# EAGLE board RK05ex (EAGLE 6.6.0), part 1 of 2
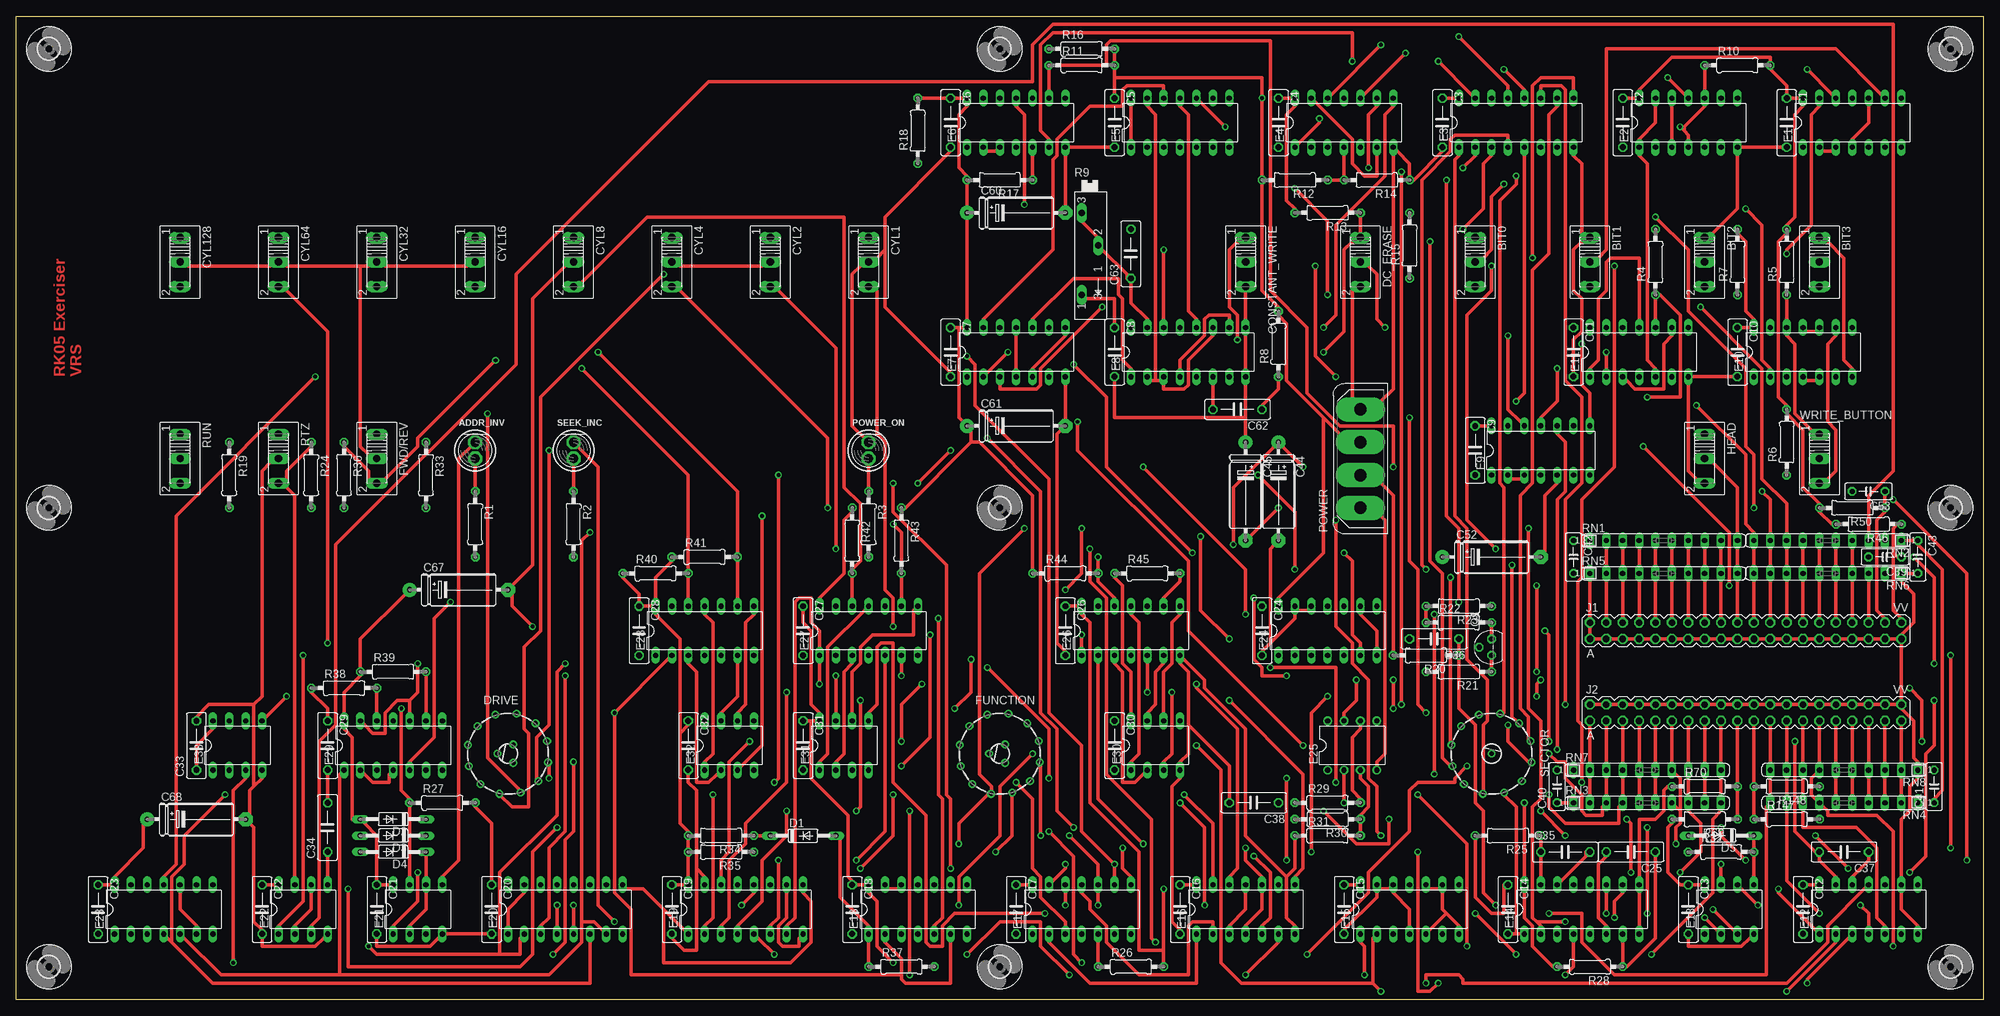
[diagram p5: board, top side]
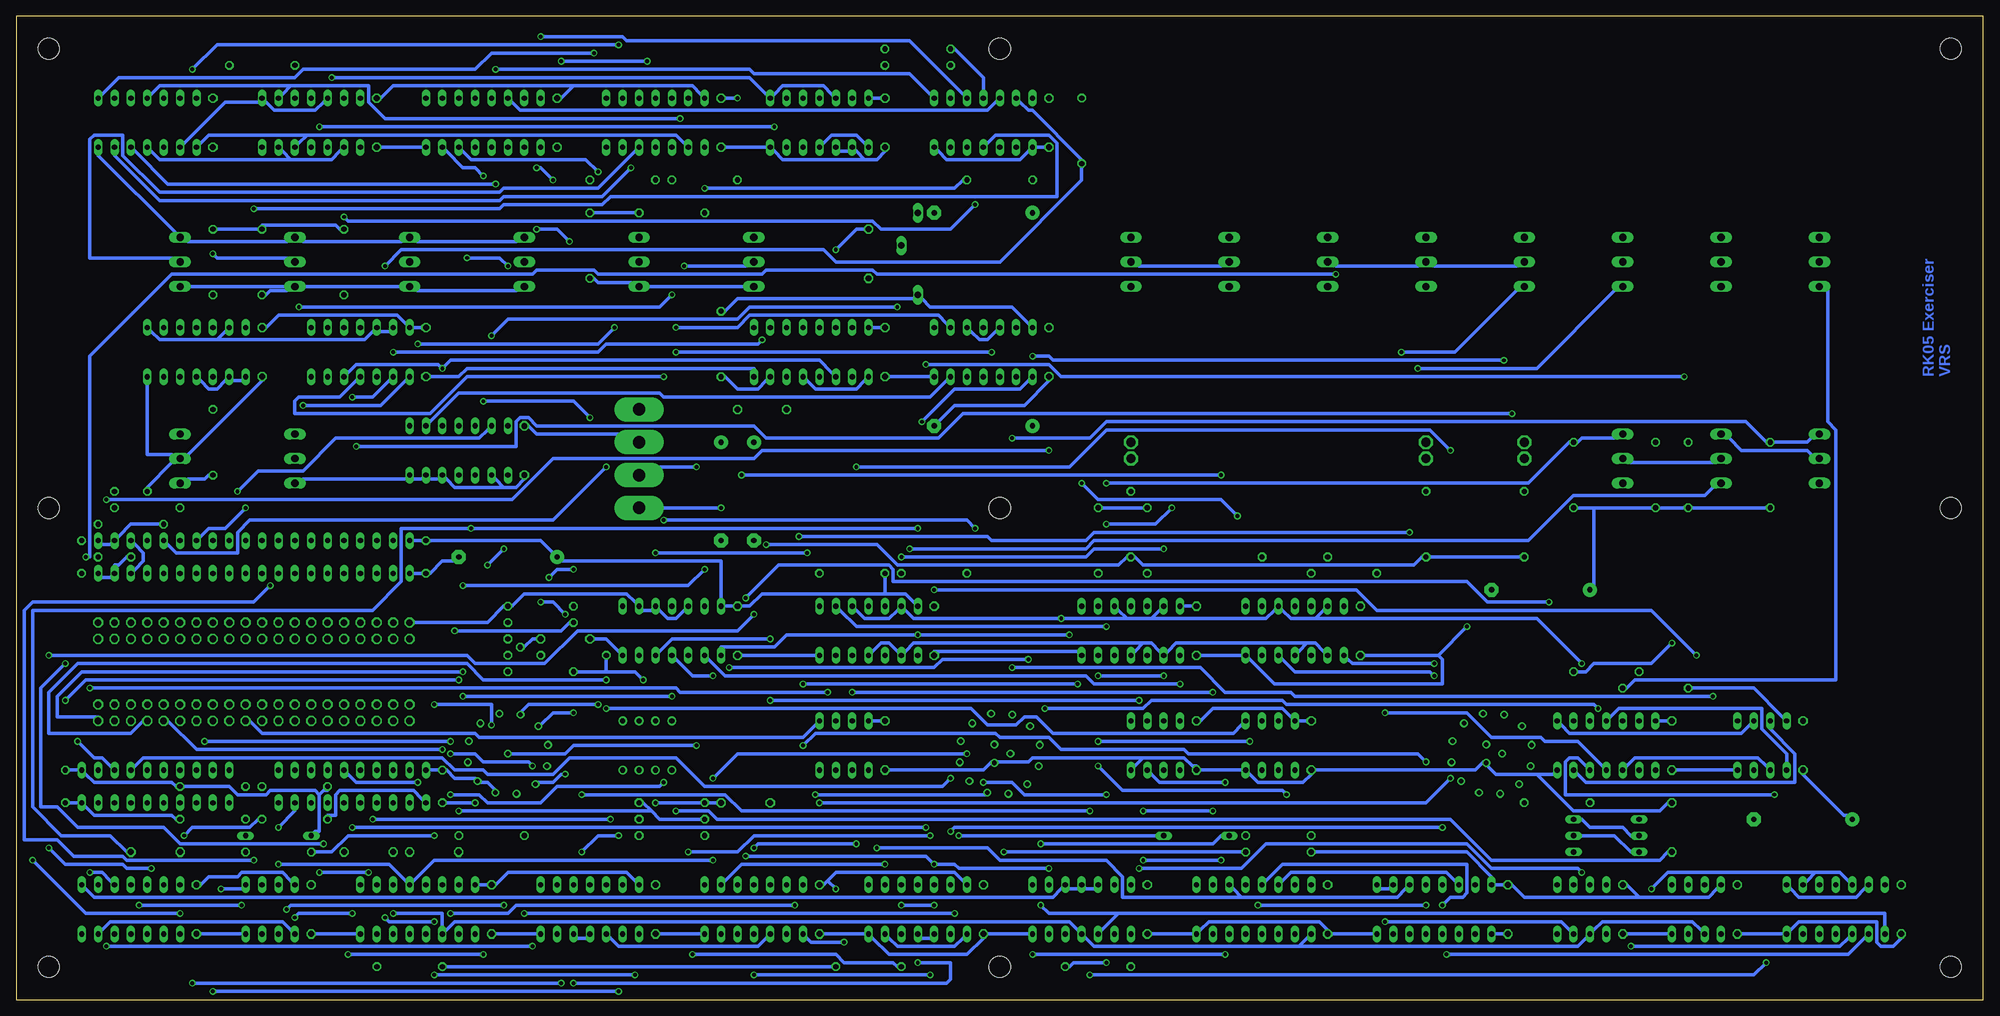
[diagram p6: board, bottom side, seen from below]

Size 304.8 x 152.4 mm. Coordinates in mm from the lower left corner, seen from the top.
Outline: 0,0 0,152.4 304.8,152.4 304.8,0 0,0
Copper layers (1*16): Top 0.035mm / dielectric 1.5mm / Bottom 0.035mm
Design rules "10mils": minimum track width 10mil, minimum drill 24mil, track to track 10mil, track to pad 10mil, pad to pad 10mil, via to via 10mil, smd to smd 10mil, copper to edge 25mil, drill to drill 10mil, minimum pad ring 10mil, minimum via ring 8mil, stop-mask expansion 0mil, vias tented up to drill 0mil, thermal gap 10mil
Net classes: 0 default: width 0.508 mm, clearance 0.279 mm

## Footprints (pad centres in the part's own frame; a part is rotated, then mirrored left to right if it is on the bottom)
BULB = drill 1.422 octagon: A 0,0; B 0,2.54
255SB = drill 1.118 long: 1 -3.81,0; 2 0,0; 3 3.81,0
C075-032X103 = drill 0.914 octagon: 1 -3.81,0; 2 3.81,0
C050-025X075 = drill 0.813 octagon: 1 -2.54,0; 2 2.54,0
E15-5 = drill 0.813 pad 2.159: + -7.62,0 | drill 0.813 pad 2.159 octagon: - 7.62,0
DO35-10 = drill 0.813 long: A 5.08,0; C -5.08,0
DO35Z10 = drill 0.813 long: A 5.08,0; C -5.08,0
50-3POLE30 = drill 0.7 pad 1.2: 1 6.207,-1.342; 2 4.704,-4.265; 3 1.941,-6.046; 4 -1.342,-6.207; 5 -4.265,-4.704; 6 -6.046,-1.941; 7 -6.207,1.342; 8 -4.704,4.265; 9 -1.941,6.046; 10 1.342,6.207; 11 4.265,4.704; 12 6.046,1.941; C1 0.825,-1.429; C2 -1.65,0; C3 0.825,1.429
DIL14 = drill 0.813 long: 1 -7.62,-3.81; 2 -5.08,-3.81; 3 -2.54,-3.81; 4 0,-3.81; 5 2.54,-3.81; 6 5.08,-3.81; 7 7.62,-3.81; 8 7.62,3.81; 9 5.08,3.81; 10 2.54,3.81; 11 0,3.81; 12 -2.54,3.81; 13 -5.08,3.81; 14 -7.62,3.81
DIL16 = drill 0.813 long: 1 -8.89,-3.81; 2 -6.35,-3.81; 3 -3.81,-3.81; 4 -1.27,-3.81; 5 1.27,-3.81; 6 3.81,-3.81; 7 6.35,-3.81; 8 8.89,-3.81; 9 8.89,3.81; 10 6.35,3.81; 11 3.81,3.81; 12 1.27,3.81; 13 -1.27,3.81; 14 -3.81,3.81; 15 -6.35,3.81; 16 -8.89,3.81
DIL08 = drill 0.813 long: 1 -3.81,-3.81; 2 -1.27,-3.81; 3 1.27,-3.81; 4 3.81,-3.81; 5 3.81,3.81; 6 1.27,3.81; 7 -1.27,3.81; 8 -3.81,3.81
DIL08' = drill 0.813 pad 1.27: 1 -3.81,-3.81; 2 -1.27,-3.81; 3 1.27,-3.81; 4 3.81,-3.81; 5 3.81,3.81; 6 1.27,3.81; 7 -1.27,3.81; 8 -3.81,3.81
DEC40PINV = drill 1.016 octagon: A -24.13,-1.27; AA 3.81,-1.27; B -24.13,1.27; BB 3.81,1.27; C -21.59,-1.27; CC 6.35,-1.27; D -21.59,1.27; DD 6.35,1.27; E -19.05,-1.27; EE 8.89,-1.27; F -19.05,1.27; FF 8.89,1.27; H -16.51,-1.27; HH 11.43,-1.27; J -16.51,1.27; JJ 11.43,1.27; K -13.97,-1.27; KK 13.97,-1.27; L -13.97,1.27; LL 13.97,1.27; M -11.43,-1.27; MM 16.51,-1.27; N -11.43,1.27; NN 16.51,1.27; P -8.89,-1.27; PP 19.05,-1.27; R -8.89,1.27; RR 19.05,1.27; S -6.35,-1.27; SS 21.59,-1.27; T -6.35,1.27; TT 21.59,1.27; U -3.81,-1.27; UU 24.13,-1.27; V -3.81,1.27; VV 24.13,1.27; W -1.27,-1.27; X -1.27,1.27; Y 1.27,-1.27; Z 1.27,1.27
FLOPPY-4 = drill 1.93 pad 3.81 long: 1 7.62,0; 2 2.54,0; 3 -2.54,0; 4 -7.62,0
TO92E = drill 0.813 octagon: B1 -1.27,0; B2 1.27,0; E 0,1.905
0207/10 = drill 0.813 octagon: 1 -5.08,0; 2 5.08,0
SP19L = drill 1.016 long: A 5.715,-1.27; E -6.985,-1.27; S -1.905,1.27
SIL10 = drill 0.813 long: 1 -11.43,0; 2 -8.89,0; 3 -6.35,0; 4 -3.81,0; 5 -1.27,0; 6 1.27,0; 7 3.81,0; 8 6.35,0; 9 8.89,0; 10 11.43,0
50-1POLE30 = drill 0.7 pad 1.2: 1 6.207,-1.342; 2 4.704,-4.265; 3 1.941,-6.046; 4 -1.342,-6.207; 5 -4.265,-4.704; 6 -6.046,-1.941; 7 -6.207,1.342; 8 -4.704,4.265; 9 -1.941,6.046; 10 1.342,6.207; 11 4.265,4.704; 12 6.046,1.941; C 0,0
3,3 = hole 3.3: 0,0

## Placement (x,y rotation side)
ADDR_INV  [BULB]  71.12,83.82 0 top
BIT0  [255SB]  226.06,114.3 270 top
BIT1  [255SB]  243.84,114.3 270 top
BIT2  [255SB]  261.62,114.3 270 top
BIT3  [255SB]  279.4,114.3 270 top
C1  .01uf  [C075-032X103]  274.32,135.89 270 top
C2  .01uf  [C075-032X103]  248.92,135.89 270 top
C3  .01uf  [C075-032X103]  220.98,135.89 270 top
C4  .01uf  [C075-032X103]  195.58,135.89 270 top
C5  .01uf  [C075-032X103]  170.18,135.89 270 top
C6  .01uf  [C075-032X103]  144.78,135.89 270 top
C7  .01uf  [C075-032X103]  144.78,100.33 270 top
C8  .01uf  [C075-032X103]  170.18,100.33 270 top
C9  .01uf  [C075-032X103]  226.06,85.09 270 top
C10  .01uf  [C075-032X103]  266.7,100.33 270 top
C11  .01uf  [C075-032X103]  241.3,100.33 270 top
C12  .01uf  [C075-032X103]  276.86,13.97 270 top
C13  .01uf  [C075-032X103]  259.08,13.97 270 top
C14  .01uf  [C075-032X103]  231.14,13.97 270 top
C15  .01uf  [C075-032X103]  205.74,13.97 270 top
C16  .01uf  [C075-032X103]  180.34,13.97 270 top
C17  .01uf  [C075-032X103]  154.94,13.97 270 top
C18  .01uf  [C075-032X103]  129.54,13.97 270 top
C19  .01uf  [C075-032X103]  101.6,13.97 270 top
C20  .01uf  [C075-032X103]  73.66,13.97 270 top
C21  .01uf  [C075-032X103]  55.88,13.97 270 top
C22  .01uf  [C075-032X103]  38.1,13.97 270 top
C23  .01uf  [C075-032X103]  12.7,13.97 270 top
C24  .01uf  [C075-032X103]  193.04,57.15 270 top
C25  470pf  [C075-032X103]  250.19,22.86 180 top
C26  .01uf  [C075-032X103]  162.56,57.15 270 top
C27  .01uf  [C075-032X103]  121.92,57.15 270 top
C28  .01uf  [C075-032X103]  96.52,57.15 270 top
C29  .01uf  [C075-032X103]  48.26,39.37 270 top
C30  .01uf  [C075-032X103]  170.18,39.37 270 top
C31  .01uf  [C075-032X103]  121.92,39.37 270 top
C32  .01uf  [C075-032X103]  104.14,39.37 270 top
C33  .01uf  [C075-032X103]  27.94,39.37 90 top
C34  .001uf  [C075-032X103]  48.26,26.67 90 top
C35  470pf  [C075-032X103]  240.03,22.86 0 top
C36  .033uf  [C075-032X103]  219.71,55.88 180 top
C37  .001uf  [C075-032X103]  283.21,22.86 180 top
C38  100pf  [C075-032X103]  191.77,30.48 180 top
C39  .001  [C050-025X075]  289.56,68.58 180 top
C40  .22uf  [C050-025X075]  238.76,33.02 90 top
C41  .22uf  [C050-025X075]  297.18,33.02 90 top
C42  .22uf  [C050-025X075]  241.3,68.58 270 top
C43  .22uf  [C050-025X075]  294.64,68.58 270 top
C44  6.8uf  [E15-5]  195.58,78.74 270 top
C45  6.8uf  [E15-5]  190.5,78.74 270 top
C52  39uf  [E15-5]  228.6,68.58 0 top
C53  .001  [C050-025X075]  287.02,78.74 180 top
C60  6.8uf  [E15-5]  154.94,121.92 0 top
C61  6.8uf  [E15-5]  154.94,88.9 0 top
C62  27pf  [C075-032X103]  189.23,91.44 180 top
C63  47pf  [C075-032X103]  172.72,115.57 90 top
C67  6.8uf  [E15-5]  68.58,63.5 0 top
C68  6.8uf  [E15-5]  27.94,27.94 0 top
CONSTANT_WRITE  [255SB]  190.5,114.3 270 top
CYL1  [255SB]  132.08,114.3 270 top
CYL2  [255SB]  116.84,114.3 270 top
CYL4  [255SB]  101.6,114.3 270 top
CYL8  [255SB]  86.36,114.3 270 top
CYL16  [255SB]  71.12,114.3 270 top
CYL32  [255SB]  55.88,114.3 270 top
CYL64  [255SB]  40.64,114.3 270 top
CYL128  [255SB]  25.4,114.3 270 top
D1  D664  [DO35-10]  121.92,25.4 0 top
D2  D664  [DO35-10]  58.42,27.94 180 top
D3  D664  [DO35-10]  58.42,25.4 180 top
D4  D664  [DO35-10]  58.42,22.86 180 top
D5  1N746  [DO35Z10]  264.16,25.4 180 top
DC_ERASE  [255SB]  208.28,114.3 270 top
DRIVE  50-3POLE30  [50-3POLE30]  76.2,38.1 0 top
E1  74LS10N  [DIL14]  284.48,135.89 0 top
E2  74LS74N  [DIL14]  259.08,135.89 0 top
E3  74LS42N  [DIL16]  232.41,135.89 0 top
E4  74LS20N  [DIL14]  205.74,135.89 0 top
E5  74LS74N  [DIL14]  180.34,135.89 0 top
E6  74LS04N  [DIL14]  154.94,135.89 0 top
E7  74LS00N  [DIL14]  154.94,100.33 0 top
E8  74123N  [DIL16]  181.61,100.33 0 top
E9  N8881N  [DIL14]  236.22,85.09 0 top
E10  74LS00N  [DIL14]  276.86,100.33 0 top
E11  74LS74N  [DIL14]  251.46,100.33 0 top
E12  74LS04N  [DIL14]  287.02,13.97 0 top
E13  DS75451N  [DIL08]  265.43,13.97 0 top
E14  74LS123N  [DIL16]  242.57,13.97 0 top
E15  74LS00N  [DIL14]  215.9,13.97 0 top
E16  74LS10N  [DIL14]  190.5,13.97 0 top
E17  74LS00N  [DIL14]  165.1,13.97 0 top
E18  74LS74N  [DIL14]  139.7,13.97 0 top
E19  74LS193N  [DIL16]  113.03,13.97 0 top
E20  74LS193N  [DIL16]  85.09,13.97 0 top
E21  DS75451N  [DIL08]  62.23,13.97 0 top
E22  DS75451N  [DIL08]  44.45,13.97 0 top
E23  74LS10N  [DIL14]  22.86,13.97 0 top
E24  74LS20N  [DIL14]  203.2,57.15 0 top
E25  LM741P  [DIL08']  207.01,39.37 0 top
E26  74LS00N  [DIL14]  172.72,57.15 0 top
E27  74LS00N  [DIL14]  132.08,57.15 0 top
E28  74LS00N  [DIL14]  106.68,57.15 0 top
E29  74LS00N  [DIL14]  58.42,39.37 0 top
E30  DS75451N  [DIL08]  176.53,39.37 0 top
E31  DS75451N  [DIL08]  128.27,39.37 0 top
E32  DS75451N  [DIL08]  110.49,39.37 0 top
E33  DS75451N  [DIL08]  34.29,39.37 0 top
FUNCTION  50-3POLE30  [50-3POLE30]  152.4,38.1 0 top
FWD/REV  [255SB]  55.88,83.82 270 top
HEAD  [255SB]  261.62,83.82 270 top
J1  DEC40PINSV  [DEC40PINV]  267.97,57.15 0 top
J2  DEC40PINSV  [DEC40PINV]  267.97,44.45 0 top
POWER  [FLOPPY-4]  208.28,83.82 90 top
POWER_ON  [BULB]  132.08,83.82 0 top
Q1  2N4894  [TO92E]  228.6,54.61 90 top
R1  0ohm  [0207/10]  71.12,73.66 270 top
R2  0ohm  [0207/10]  86.36,73.66 270 top
R3  0ohm  [0207/10]  132.08,73.66 270 top
R4  1K  [0207/10]  254,114.3 90 top
R5  56K  [0207/10]  274.32,114.3 90 top
R6  56K  [0207/10]  274.32,86.36 90 top
R7  1K  [0207/10]  266.7,114.3 90 top
R8  5.6k  [0207/10]  195.58,101.6 90 top
R9  10K  [SP19L]  166.37,114.94 270 top
R10  1K  [0207/10]  266.7,144.78 0 top
R11  1K  [0207/10]  165.1,144.78 0 top
R12  330  [0207/10]  198.12,127 180 top
R13  330  [0207/10]  203.2,121.92 180 top
R14  750  [0207/10]  210.82,127 180 top
R15  750  [0207/10]  215.9,116.84 90 top
R16  1K  [0207/10]  165.1,147.32 0 top
R17  1K  [0207/10]  152.4,127 180 top
R18  1K  [0207/10]  139.7,134.62 90 top
R19  1K  [0207/10]  33.02,81.28 270 top
R20  470K  [0207/10]  218.44,53.34 180 top
R21  330  [0207/10]  223.52,50.8 180 top
R22  120  [0207/10]  223.52,58.42 0 top
R23  68  [0207/10]  223.52,60.96 180 top
R24  1K  [0207/10]  45.72,81.28 270 top
R25  10K  [0207/10]  231.14,25.4 180 top
R26  1K  [0207/10]  172.72,5.08 0 top
R27  1K  [0207/10]  66.04,30.48 0 top
R28  22K  [0207/10]  243.84,5.08 180 top
R29  100K  [0207/10]  203.2,30.48 0 top
R30  100K  [0207/10]  203.2,27.94 180 top
R31  1M  [0207/10]  203.2,25.4 0 top
R32  1K  [0207/10]  264.16,22.86 0 top
R33  1K  [0207/10]  63.5,81.28 270 top
R34  1K  [0207/10]  109.22,25.4 180 top
R35  1K  [0207/10]  109.22,22.86 180 top
R36  1K  [0207/10]  50.8,81.28 270 top
R37  1K  [0207/10]  137.16,5.08 0 top
R38  1K  [0207/10]  50.8,48.26 0 top
R39  1K  [0207/10]  58.42,50.8 0 top
R40  1K  [0207/10]  99.06,66.04 0 top
R41  1K  [0207/10]  106.68,68.58 0 top
R42  1K  [0207/10]  129.54,71.12 270 top
R43  1K  [0207/10]  137.16,71.12 270 top
R44  1K  [0207/10]  162.56,66.04 0 top
R45  1K  [0207/10]  175.26,66.04 0 top
R46  390  [0207/10]  287.02,73.66 180 top
R50  390  [0207/10]  284.48,76.2 180 top
R69  180  [0207/10]  261.62,27.94 180 top
R70  390  [0207/10]  261.62,33.02 0 top
R147  180  [0207/10]  274.32,27.94 0 top
R148  390  [0207/10]  274.32,33.02 180 top
RN1  180  [SIL10]  255.27,71.12 0 top
RN2  180  [SIL10]  280.67,71.12 180 top
RN3  180  [SIL10]  252.73,30.48 0 top
RN4  180  [SIL10]  283.21,30.48 180 top
RN5  390  [SIL10]  255.27,66.04 0 top
RN6  390  [SIL10]  280.67,66.04 180 top
RN7  390  [SIL10]  252.73,35.56 0 top
RN8  390  [SIL10]  283.21,35.56 180 top
RTZ  [255SB]  40.64,83.82 270 top
RUN  [255SB]  25.4,83.82 270 top
SECTOR  50-1POLE30  [50-1POLE30]  228.6,38.1 270 top
SEEK_INC  [BULB]  86.36,83.82 0 top
U$1  [3,3]  5.08,147.32 0 top
U$2  [3,3]  5.08,5.08 0 top
U$3  [3,3]  5.08,76.2 0 top
U$4  [3,3]  299.72,147.32 0 top
U$5  [3,3]  299.72,5.08 0 top
U$6  [3,3]  299.72,76.2 0 top
U$7  [3,3]  152.4,147.32 0 top
U$8  [3,3]  152.4,5.08 0 top
U$9  [3,3]  152.4,76.2 0 top
WRITE_BUTTON  MOM  [255SB]  279.4,83.82 270 top

## Tracks (layer width: path | path; a pad name or v marks a point on that pad's centre or on a via)
0BIT  (via drill 0.61)
  Top 0.508: v209.55,128.91 209.55,137.16 210.82,138.43 E4.9
  Bottom 0.508: v209.55,128.91 214,124.46 229.24,124.46 229.87,123.83 282.57,123.83 289.56,130.81 E1.6
1.44MHZ
  Top 0.508: E8.12 182.88,105.41 181.61,106.68 181.61,137.16 180.34,138.43 E5.11
1BIT  (via drill 0.61)
  Top 0.508: v215.26,146.69 208.91,140.34 E4.10
  Bottom 0.508: v215.26,146.69 231.14,146.69 233.68,144.15 260.35,144.15 261.62,142.88 288.93,142.88 291.46,140.34 E1.8
1L  (via drill 0.61)
  Top 0.508: E7.13 149.86,105.41 160.66,116.2 160.66,130.18 161.29,130.81 161.29,133.35 166.37,138.43 171.45,138.43 171.45,140.97 172.09,141.6 177.8,141.6 177.8,140.97 E5.12 | v255.91,142.88 258.44,140.34 E2.11
  Bottom 0.508: E5.12 178.44,140.34 179.71,141.6 186.06,141.6 187.32,140.34 E5.8 188.59,140.34 191.13,142.88 v255.91,142.88
2.88MHZ
  Top 0.508: E8.4 180.34,97.79 180.34,99.06 184.15,102.87 184.15,105.41 184.78,106.05 187.96,106.05 187.96,105.41 E8.10
2BIT  (via drill 0.61)
  Top 0.508: v211.46,147.96 203.84,140.34 E4.12 | v277.5,144.15 281.31,140.34 E1.12
  Bottom 0.508: v211.46,147.96 273.69,147.96 v277.5,144.15
2H  (via drill 0.61)
  Top 0.508: v201.93,136.53 201.93,135.89 198.75,132.72 E4.1
  Bottom 0.508: v201.93,136.53 247.65,136.53 250.19,139.06 250.19,141.6 262.25,141.6 | 262.25,141.6 263.52,140.34 E2.9 | 262.25,141.6 282.57,141.6 283.85,140.34 E1.11
2L
  Top 0.508: E1.2 280.04,131.44 281.31,131.44 E1.3 | E2.3 256.54,133.35 256.54,138.43 E2.12
  Bottom 0.508: E2.12 257.18,139.06 258.44,137.79 264.8,137.79 266.06,139.06 E2.8 267.33,139.06 272.42,139.06 278.76,132.72 E1.2
3BIT
  Top 0.508: E4.13 201.29,139.06 207.01,133.35 207.01,129.54 208.91,127.64 210.82,127.64 210.82,130.81 E4.6
4H
  Bottom 0.508: 259.71,133.99 202.56,133.99 201.29,132.72 E4.2 | 259.71,133.99 260.99,132.72 E2.5 | 259.71,133.99 274.95,133.99 276.23,132.72 E1.1
4L
  Top 0.508: E1.4 284.48,133.35 287.02,135.89 287.02,138.43 E1.10
  Bottom 0.508: 262.25,130.18 255.91,130.18 254.63,131.44 E2.2 | 262.25,130.18 263.52,131.44 E2.6 | 262.25,130.18 282.57,130.18 283.85,131.44 E1.4
202_DETECT_L  (via drill 0.61)
  Top 0.508: v46.35,96.52 24.77,74.93 24.77,20.95 22.86,19.05 E23.11 | v163.83,98.42 168.91,93.34 168.91,82.55 v182.25,69.22 | v205.74,69.22 207.01,67.94 207.01,56.52 208.28,55.24 208.28,54.61 E24.6
  Bottom 0.508: v46.35,96.52 142.88,96.52 144.78,98.42 v163.83,98.42 | v182.25,69.22 v205.74,69.22
+3V  (via drill 0.61)
  Top 0.508: E22.2 43.18,11.43 45.72,13.97 45.72,16.51 E22.6 | E21.2 60.96,11.43 63.5,13.97 63.5,16.51 E21.6 63.5,19.05 63.5,22.23 D4.C | v246.38,13.34 246.38,16.51 E14.11 | 100.33,13.97 97.16,17.14 94.61,17.14 E20.9 | 100.33,13.97 103.5,10.79 E19.1 | 100.33,13.97 100.33,5.71 120.02,5.71 123.19,8.89 123.19,15.24 121.92,16.51 E19.9
  Bottom 0.508: E22.2 43.81,10.79 45.09,12.06 59.05,12.06 60.33,10.79 E21.2 61.59,9.53 62.87,8.26 106.05,8.26 | v246.38,13.34 238.76,13.34 238.76,11.43 E14.3 238.12,10.79 236.85,12.06 141.6,12.06 140.34,10.79 E18.4 139.06,9.53 137.79,8.26 106.05,8.26 | 106.05,8.26 104.78,9.53 E19.1 | E20.10 92.08,17.14 93.34,17.14 E20.9
+3VA  (via drill 0.61)
  Top 0.508: v153.67,100.33 150.5,97.16 E7.2 | v202.56,100.33 205.74,103.5 205.74,116.2 207.01,117.47 DC_ERASE.1 208.28,118.75 208.28,121.28 R13.1
  Bottom 0.508: v202.56,100.33 v153.67,100.33 | R15.2 215.26,121.92 208.91,121.92 R13.1
+3VB
  Top 0.508: R12.1 203.84,127 205.1,127 R14.2 205.74,127.64 205.74,130.81 E4.4
+3VC  (via drill 0.61)
  Top 0.508: v252.73,93.34 257.81,93.34 257.81,106.05 254.63,109.22 R4.1 254,108.58 254,105.41 E11.10 | v189.23,102.23 189.23,106.05 187.96,107.31 187.96,116.2 189.23,117.47 CONSTANT_WRITE.1 | v246.38,100.33 246.38,97.79 E11.2
  Bottom 0.508: v252.73,93.34 249.56,93.34 247.01,95.89 E11.2 | v189.23,102.23 189.87,101.6 213.36,101.6 214.63,100.33 v246.38,100.33
+15V  (via drill 0.61)
  Top 0.508: v207.65,49.53 207.65,46.35 205.74,44.45 E25.7 | v199.39,82.55 196.22,85.72 C44.+ 194.94,85.72 188.59,79.38 v188.59,70.48 | R20.2 213.36,53.98 213.36,78.11 211.46,80.01 POWER.3
  Bottom 0.508: R1.2 71.75,68.58 85.72,68.58 R2.2 87,68.58 88.27,67.31 130.18,67.31 131.44,68.58 R3.2 132.72,68.58 133.99,67.31 168.28,67.31 171.45,70.48 v188.59,70.48 | v207.65,49.53 208.91,50.8 213.36,50.8 | 213.36,50.8 217.81,50.8 R21.2 | 213.36,50.8 213.36,52.7 R20.2 | v199.39,82.55 205.1,82.55 POWER.3
-15V  (via drill 0.61)
  Top 0.508: E25.4 210.82,36.83 212.09,38.1 212.09,74.3 211.46,74.93 POWER.4 | v195.58,76.2 191.13,71.75 C45.-
  Bottom 0.508: v195.58,76.2 205.1,76.2 POWER.4
ADDR_COUNTER_1  (via drill 0.61)
  Top 0.508: v119.38,47.62 119.38,33.66 113.03,27.3 113.03,24.13 110.49,21.59 110.49,12.7 109.22,11.43 E19.3 | v175.26,47.62 175.26,52.07 E26.5
  Bottom 0.508: v119.38,47.62 v175.26,47.62
ADDR_COUNTER_2  (via drill 0.61)
  Top 0.508: v107.95,31.75 107.95,12.7 106.68,11.43 E19.2 | v137.16,36.2 141.6,40.64 v141.6,56.52 | v165.1,56.52 165.1,54.61 E26.1
  Bottom 0.508: v107.95,31.75 108.58,32.38 133.35,32.38 v137.16,36.2 | v141.6,56.52 v165.1,56.52 185.42,56.52 187.32,54.61 195.58,54.61 E24.1
ADDR_COUNTER_4  (via drill 0.61)
  Top 0.508: v118.11,21.59 118.11,12.7 116.84,11.43 E19.6 | v130.18,21.59 134.62,26.04 134.62,52.07 E27.5
  Bottom 0.508: v118.11,21.59 v130.18,21.59
ADDR_COUNTER_8  (via drill 0.61)
  Top 0.508: E19.7 119.38,11.43 120.65,12.7 120.65,61.59 121.28,62.23 123.19,62.23 123.19,58.42 124.46,57.15 124.46,54.61 E27.1 124.46,52.07 v124.46,48.9
  Bottom 0.508: v124.46,48.9 137.79,48.9 139.06,50.16 194.94,50.16 197.49,52.7 E24.2
ADDR_COUNTER_16  (via drill 0.61)
  Top 0.508: v85.09,50.16 85.09,26.04 82.55,23.5 82.55,12.7 81.28,11.43 E20.3
  Bottom 0.508: v85.09,50.16 85.72,50.8 106.68,50.8 108.58,52.7 E28.5
ADDR_COUNTER_32  (via drill 0.61)
  Top 0.508: v54.61,8.26 55.88,6.99 74.93,6.99 | 74.93,6.99 78.11,6.99 78.11,9.53 E20.2 | v85.09,52.07 83.82,50.8 83.82,28.57 74.93,19.68 74.93,6.99
  Bottom 0.508: v54.61,8.26 22.23,8.26 20.95,9.53 E23.3 | v85.09,52.07 97.79,52.07 98.42,52.7 E28.1
ADDR_COUNTER_64  (via drill 0.61)
  Top 0.508: 24.13,8.89 30.48,2.54 88.9,2.54 88.9,8.89 E20.6 | 24.13,8.89 23.5,9.53 E23.4 | v32.38,31.75 26.04,25.4 26.04,20.95 24.13,19.05 24.13,8.89 | v196.85,50.16 193.04,50.16 193.04,51.44 191.77,52.7 v191.77,62.23 | v67.31,61.59 64.77,59.05 64.77,40.64 60.96,36.83 E29.5
  Bottom 0.508: v32.38,31.75 64.77,31.75 64.77,36.83 64.14,37.47 62.87,37.47 61.59,36.2 E29.5 | v196.85,50.16 200.03,50.16 202.56,52.7 E24.4 | v191.77,62.23 186.69,67.31 169.54,67.31 168.91,66.67 168.91,64.77 80.01,64.77 76.83,61.59 v67.31,61.59
ADDR_COUNTER_128  (via drill 0.61)
  Top 0.508: 50.16,3.81 31.75,3.81 26.04,9.53 E23.5 | 50.16,3.81 50.16,34.92 E29.1 | 87.63,12.06 89.53,12.06 90.81,10.79 E20.7 | 87.63,12.06 87.63,8.89 82.55,3.81 50.16,3.81 | v187.96,55.88 183.51,60.33 v183.51,71.75 | v88.9,72.39 87.63,71.12 87.63,12.06
  Bottom 0.508: v187.96,55.88 203.2,55.88 205.1,53.98 E24.5 | v183.51,71.75 154.31,71.75 153.67,71.12 139.06,71.12 137.79,72.39 v88.9,72.39
ADDR_SOURCE_H  (via drill 0.61)
  Top 0.508: 60.96,46.35 59.05,46.35 57.15,44.45 57.15,41.27 55.24,41.27 53.98,42.55 E29.13 | 60.96,46.35 60.96,44.45 E29.10 | v142.88,59.05 142.88,31.75 143.51,31.11 143.51,12.7 142.24,11.43 E18.5 | 60.96,46.35 62.23,47.62 v62.23,52.07
  Bottom 0.508: E26.10 174.62,60.33 173.35,59.05 169.54,59.05 168.28,60.33 E26.13 167,60.33 165.74,59.05 v142.88,59.05 132.72,59.05 | 103.5,59.05 102.23,60.33 E28.13 | 103.5,59.05 107.31,59.05 108.58,60.33 E28.10 109.86,60.33 111.12,59.05 128.91,59.05 | 128.91,59.05 127.64,60.33 E27.13 | 128.91,59.05 132.72,59.05 | 132.72,59.05 133.99,60.33 E27.10 | v62.23,52.07 69.22,59.05 103.5,59.05
ADDR_SOURCE_L  (via drill 0.61)
  Top 0.508: 137.16,3.81 137.16,3.17 137.79,2.54 144.78,2.54 144.78,8.89 E18.6 | 137.16,3.81 137.16,6.35 134.62,8.89 E18.2 | E16.4 190.5,11.43 193.04,13.97 193.04,16.51 E16.10 193.04,19.05 190.5,21.59 v190.5,23.5 | E29.2 53.98,34.92 55.24,33.66 57.78,33.66 57.78,34.92 E29.4 | E28.2 100.97,52.7 v92.71,44.45 92.71,16.51 95.25,13.97 95.25,3.81 137.16,3.81 | v174.62,24.13 167.64,31.11 167.64,52.07 E26.2
  Bottom 0.508: E26.4 172.09,53.98 170.81,55.24 169.54,55.24 168.28,53.98 E26.2 167,53.98 165.74,55.24 130.18,55.24 | 130.18,55.24 128.91,55.24 127.64,53.98 E27.2 126.36,53.98 125.09,55.24 104.78,55.24 | 130.18,55.24 131.44,53.98 E27.4 | 104.78,55.24 103.5,55.24 102.23,53.98 E28.2 | 104.78,55.24 106.05,53.98 E28.4 | v92.71,44.45 80.01,44.45 76.2,40.64 68.58,40.64 67.94,40.01 62.87,40.01 59.05,36.2 E29.4 | v190.5,23.5 189.87,24.13 v174.62,24.13
ADDRESS_INVALID_L
  Top 0.508: E21.5 66.04,19.05 68.58,21.59 68.58,83.82 70.48,85.72 ADDR_INV.B
BIT_0L  (via drill 0.61)
  Top 0.508: v230.5,126.36 228.6,124.46 228.6,116.2 227.33,114.94 BIT0.2
  Bottom 0.508: v230.5,126.36 281.31,126.36 286.38,131.44 E1.5
BIT_1L
  Top 0.508: E1.9 288.93,140.34 281.94,147.32 246.38,147.32 246.38,116.2 245.11,114.94 BIT1.2
BIT_2L  (via drill 0.61)
  Top 0.508: v274.32,115.57 274.32,116.2 278.13,120.02 278.13,137.16 279.4,138.43 E1.13
  Bottom 0.508: v274.32,115.57 273.69,114.94 262.89,114.94 BIT2.2
BIT_3L
  Bottom 0.508: E4.5 208.91,131.44 214.63,125.73 229.24,125.73 229.87,125.09 282.57,125.09 288.29,130.81 288.29,133.99 292.74,133.99 293.37,133.35 293.37,114.94 280.67,114.94 BIT3.2
BUS_AC_LO_L
  Top 0.508: 290.83,69.22 291.46,68.58 C39.1 | 290.83,69.22 290.83,73.03 291.46,73.66 R46.1 | 290.83,69.22 290.83,60.33 292.1,59.05 J1.VV
BUS_ADDR_ACCEPTED_L
  Top 0.508: RN3.5 251.46,31.75 251.46,34.29 RN7.5 251.46,36.83 251.46,42.55 J2.H
BUS_ADDRESS_INVALID_L  (via drill 0.61)
  Top 0.508: R26.1 167.64,5.71 167.64,8.89 E17.5 | J2.C 246.38,42.55 246.38,36.83 RN7.3 246.38,34.29 246.38,31.75 RN3.3 245.75,29.84 245.75,28.57 243.21,28.57 242.57,29.21 242.57,31.75 240.03,34.29 240.03,36.83 238.76,36.83 v237.49,38.1 | v200.03,6.99 209.55,16.51 209.55,19.68 215.9,26.04 215.9,32.38 217.17,33.66 222.88,33.66 222.88,34.29 v224.79,36.2
  Bottom 0.508: v200.03,6.99 177.8,6.99 176.53,5.71 168.91,5.71 168.28,5.08 R26.1 | v224.79,36.2 225.43,36.83 232.41,36.83 233.68,38.1 v237.49,38.1
BUS_CA_00_L
  Top 0.508: R147.1 269.24,28.57 269.24,32.38 R148.2 269.24,33.66 269.24,42.55 J2.Y
  Bottom 0.508: E30.5 180.97,42.55 182.88,40.64 233.04,40.64 233.68,41.27 266.7,41.27 268.61,43.18 J2.Y
BUS_CA_01_L  (via drill 0.61)
  Top 0.508: RN4.3 289.56,31.75 289.56,34.29 RN8.3 289.56,36.83 289.56,42.55 J2.SS | v179.07,47.62 179.07,38.1 177.8,36.83 E30.3 | v293.37,48.26 295.27,46.35 v295.27,40.01
  Bottom 0.508: v179.07,47.62 201.93,47.62 202.56,48.26 v293.37,48.26 | v295.27,40.01 292.74,37.47 291.46,37.47 290.19,36.2 RN8.3
BUS_CA_02_L  (via drill 0.61)
  Top 0.508: v159.38,13.34 145.41,13.34 143.51,11.43 143.51,8.26 141.6,8.26 140.97,8.89 140.97,28.57 135.89,33.66 135.89,55.24 133.99,55.24 133.35,54.61 133.35,45.72 132.08,44.45 E31.5 | v232.41,6.99 v226.06,13.34 | v253.37,6.99 262.89,16.51 262.89,27.94 264.16,29.21 RN3.10 264.16,31.75 264.16,34.29 RN7.10 264.16,36.83 264.16,42.55 J2.U
  Bottom 0.508: v226.06,13.34 v159.38,13.34 | v253.37,6.99 v232.41,6.99
BUS_CA_03_L  (via drill 0.61)
  Top 0.508: RN4.2 292.1,31.75 292.1,34.29 RN8.2 292.1,36.83 292.1,42.55 J2.UU | v117.47,33.66 118.11,34.29 v118.11,81.28 | v192.41,81.28 198.12,75.56 v198.12,66.67 | v235.59,64.14 v235.59,50.8
  Bottom 0.508: v117.47,33.66 127.64,33.66 128.91,34.92 E31.3 | v192.41,81.28 v118.11,81.28 | v198.12,66.67 200.66,64.14 v235.59,64.14 | v235.59,50.8 294.64,50.8 298.45,46.99 298.45,43.81 292.1,43.81 J2.UU
BUS_CA_04_L  (via drill 0.61)
  Top 0.508: RN4.5 284.48,31.75 284.48,34.29 RN8.5 284.48,36.83 284.48,42.55 J2.MM | v213.36,45.09 v213.36,49.53
  Bottom 0.508: v213.36,45.09 156.84,45.09 154.31,42.55 149.86,42.55 148.59,43.81 146.69,43.81 144.15,41.27 116.2,41.27 114.94,42.55 E32.5 | v213.36,49.53 232.41,49.53 234.95,52.07 295.27,52.07 299.72,47.62 299.72,41.27 287.02,41.27 285.12,43.18 J2.MM
BUS_CA_05_L  (via drill 0.61)
  Top 0.508: v115.57,74.93 115.57,39.37 112.39,36.2 E32.3 | v144.78,85.09 v139.7,80.01 | v290.83,77.47 302.26,66.04 v302.26,21.59 | v279.4,13.34 274.32,18.41 274.32,29.21 RN4.9 274.32,31.75 274.32,34.29 RN8.9 274.32,36.83 274.32,42.55 J2.CC
  Bottom 0.508: v115.57,74.93 118.11,77.47 137.16,77.47 v139.7,80.01 | v144.78,85.09 189.23,85.09 190.5,83.82 221.62,83.82 227.97,77.47 v290.83,77.47 | v302.26,21.59 294,13.34 v279.4,13.34
BUS_CA_06_L  (via drill 0.61)
  Top 0.508: RN4.4 287.02,31.75 287.02,34.29 RN8.4 287.02,36.83 287.02,42.55 J2.PP | v41.91,46.99 38.73,43.81 E33.5 | v150.5,51.44 160.02,41.91 v160.02,34.29
  Bottom 0.508: v41.91,46.99 106.68,46.99 107.31,47.62 117.47,47.62 121.28,51.44 v150.5,51.44 | v160.02,34.29 161.29,33.02 198.12,33.02 202.56,37.47 219.07,37.47 221.62,34.92 231.78,34.92 232.41,35.56 236.85,35.56 238.76,37.47 285.12,37.47 286.38,36.2 RN8.4
BUS_CA_07_L  (via drill 0.61)
  Top 0.508: v33.66,5.71 33.66,32.38 35.56,34.29 E33.3 | v138.43,3.81 v138.43,29.21 | v217.17,31.75 224.79,24.13 v224.79,8.26 | v290.83,8.26 290.83,26.04 288.29,28.57 280.67,28.57 280.67,29.21 280.04,29.84 RN4.7 278.76,31.11 278.13,31.75 278.13,34.29 278.76,34.92 RN8.7 279.4,36.83 279.4,42.55 J2.HH
  Bottom 0.508: v33.66,5.71 35.56,3.81 v138.43,3.81 | v138.43,29.21 192.41,29.21 194.94,31.75 v217.17,31.75 | v224.79,8.26 v290.83,8.26
BUS_DATA&CLOCK_L  (via drill 0.61)
  Top 0.508: RN4.6 281.94,31.75 281.94,34.29 RN8.6 281.94,36.83 281.94,42.55 J2.KK | v238.76,38.73 238.76,77.47 240.03,78.74 240.03,86.36 238.76,87.63 E9.10
  Bottom 0.508: v238.76,38.73 276.86,38.73 281.31,43.18 J2.KK
BUS_DC_LO_L
  Top 0.508: C53.1 289.56,78.11 289.56,76.83 R50.1 289.56,75.56 288.29,74.3 288.29,60.33 289.56,59.05 J1.TT
BUS_FILE_READY
  Top 0.508: RN1.9 264.16,69.85 264.16,67.31 RN5.9 264.16,64.77 264.16,59.05 J1.V
BUS_HIGH_DENSITY_L
  Top 0.508: RN1.6 256.54,69.85 256.54,67.31 RN5.6 256.54,64.77 256.54,59.05 J1.N
BUS_INDEX_L  (via drill 0.61)
  Top 0.508: J1.Z 269.24,59.05 269.24,64.77 RN6.10 269.24,67.31 269.24,69.85 RN2.10 269.24,72.39 267.97,73.66 267.97,84.45 v260.35,92.08 | E11.1 243.84,97.79 245.11,99.06 245.11,108.58 246.38,109.86 246.38,114.3 247.01,114.94 251.46,114.94 251.46,105.41 E11.11
  Bottom 0.508: v260.35,92.08 248.28,92.08 244.47,95.89 E11.1
BUS_READ_GATE_L
  Top 0.508: RN1.5 254,69.85 254,67.31 RN5.5 254,64.77 254,59.05 J1.L
BUS_RESTORE_L  (via drill 0.61)
  Top 0.508: E22.5 48.26,19.05 48.26,22.23 C34.1 | J2.P 259.08,42.55 259.08,36.83 RN7.8 259.08,34.29 259.08,31.75 RN3.8 259.08,29.21 260.99,27.3 260.99,22.86 v257.81,19.68 | v202.56,29.21 207.65,24.13 212.72,24.13 v212.72,27.94 | v249.56,27.94 250.19,27.3 v250.19,19.68
  Bottom 0.508: v202.56,29.21 197.49,29.21 196.22,27.94 82.55,27.94 76.2,21.59 50.16,21.59 48.9,22.86 C34.1 | v249.56,27.94 v212.72,27.94 | v250.19,19.68 v257.81,19.68
BUS_RWS_READY_L
  Top 0.508: E12.5 289.56,11.43 288.29,12.7 288.29,23.5 285.12,26.67 276.86,26.67 276.86,29.21 RN4.8 276.86,31.75 276.86,34.29 RN8.8 276.86,36.83 276.86,42.55 J2.EE
BUS_SECTOR_ADDR_0L  (via drill 0.61)
  Top 0.508: R17.1 157.48,127.64 157.48,130.81 E6.5 | J1.DD 274.32,59.05 274.32,64.77 RN6.8 274.32,67.31 274.32,69.85 RN2.8 274.32,72.39 274.32,76.83 270.51,80.64 270.51,97.79 v260.99,107.31 | v198.12,125.73 203.2,120.65 v203.2,109.22
  Bottom 0.508: v198.12,125.73 159.38,125.73 158.12,127 R17.1 | v203.2,109.22 205.1,107.31 v260.99,107.31
BUS_SECTOR_ADDR_1L  (via drill 0.61)
  Top 0.508: RN3.6 254,31.75 254,34.29 RN7.6 254,36.83 254,42.55 J2.K | v242.57,33.66 242.57,42.55 241.94,43.18 241.94,64.77 242.57,65.41 242.57,77.47 247.65,82.55 v247.65,113.67
  Bottom 0.508: E6.13 149.22,139.06 147.96,137.79 147.32,137.79 139.7,130.18 R18.1 139.7,128.91 139.7,127 152.4,114.3 177.8,114.3 179.71,116.2 245.11,116.2 v247.65,113.67 | v242.57,33.66 252.09,33.66 253.37,34.92 RN7.6
BUS_SECTOR_ADDR_2L  (via drill 0.61)
  Top 0.508: RN2.7 276.86,69.85 276.86,67.31 RN6.7 276.86,64.77 276.86,59.05 J1.FF | v156.21,123.19 156.21,137.16 154.94,138.43 E6.11 | v254,121.28 259.08,116.2 259.08,106.68 267.97,97.79 267.97,85.72 269.24,84.45 v269.24,76.2
  Bottom 0.508: E6.11 154.94,140.97 154.94,142.88 159.38,147.32 R16.1 | v156.21,123.19 160.02,119.38 170.81,119.38 172.09,120.65 253.37,120.65 v254,121.28 | v269.24,76.2 272.42,73.03 274.95,73.03 276.23,71.75 RN2.7
BUS_SECTOR_ADDR_3L  (via drill 0.61)
  Top 0.508: E6.9 160.02,140.97 160.02,144.15 R11.1 160.66,144.78 168.91,144.78 168.91,147.96 169.54,148.59 194.31,148.59 194.31,109.86 200.03,104.14 200.03,93.98 205.1,88.9 213.36,88.9 v213.36,82.55 | RN2.5 281.94,69.85 281.94,67.31 RN6.5 281.94,64.77 281.94,59.05 J1.LL
  Bottom 0.508: v213.36,82.55 221.62,74.3 268.61,74.3 270.51,72.39 270.51,69.22 280.04,69.22 281.31,70.48 RN2.5
BUS_SECTOR_PULSE_L
  Top 0.508: RN1.8 261.62,69.85 261.62,67.31 RN5.8 261.62,64.77 261.62,59.05 J1.T
BUS_SEEK_INCOMPLETE_L  (via drill 0.61)
  Top 0.508: E21.7 60.96,19.05 60.96,29.84 R27.1 60.96,31.11 59.69,32.38 v59.69,45.09 | J2.E 248.92,42.55 248.92,36.83 RN7.4 248.92,34.29 248.92,31.75 RN3.4 248.28,29.84 248.28,27.3 240.03,27.3 237.49,29.84 v237.49,31.75 | v145.41,45.09 147.96,47.62 v147.96,52.7 | v194.31,51.44 204.47,51.44 v204.47,33.66
  Bottom 0.508: v59.69,45.09 60.33,45.72 107.95,45.72 108.58,46.35 128.91,46.35 130.18,45.09 v145.41,45.09 | v147.96,52.7 161.29,52.7 162.56,51.44 v194.31,51.44 | v204.47,33.66 205.1,33.02 220.98,33.02 223.52,30.48 231.78,30.48 233.04,31.75 v237.49,31.75
BUS_STROBE_L
  Top 0.508: RN6.3 287.02,64.77 287.02,59.05 J1.RR | E22.3 45.72,11.43 46.99,12.7 46.99,40.01 49.53,42.55 49.53,70.48 77.47,98.42 77.47,112.39 107.31,142.24 157.48,142.24 157.48,147.96 160.66,151.13 290.83,151.13 290.83,81.92 287.02,78.11 287.02,72.39 RN2.3
  Bottom 0.508: RN6.3 286.38,66.67 285.12,67.94 285.12,69.22 286.38,70.48 RN2.3
BUS_WP_SET_L
  Top 0.508: RN1.4 251.46,69.85 251.46,67.31 RN5.4 251.46,64.77 251.46,59.05 J1.J
BUS_WP_STATUS_L
  Top 0.508: RN1.7 259.08,69.85 259.08,67.31 RN5.7 259.08,64.77 259.08,59.05 J1.R
BUS_WRITE_CK
  Top 0.508: RN2.6 279.4,69.85 279.4,67.31 RN6.6 279.4,64.77 279.4,59.05 J1.JJ
BUS_WRITE_GATE_L  (via drill 0.61)
  Top 0.508: v270.51,78.74 271.78,77.47 271.78,72.39 RN2.9 271.78,69.85 271.78,67.31 RN6.9 271.78,64.77 271.78,59.05 J1.BB
  Bottom 0.508: v270.51,78.74 267.33,81.92 260.35,81.92 255.27,87 233.04,87 231.78,88.27 E9.13
CA_SW_1  (via drill 0.61)
  Top 0.508: E26.9 177.8,62.23 180.34,64.77 180.34,65.41 R45.2 | v135.89,57.78 135.89,62.23 134.62,63.5 134.62,86.36 133.35,87.63 133.35,109.86 CYL1.3
  Bottom 0.508: v135.89,57.78 174.62,57.78 177.16,60.33 E26.9
CA_SW_2  (via drill 0.61)
  Top 0.508: E26.12 170.18,62.23 167.64,64.77 167.64,65.41 R44.2 167.64,66.67 v167.64,68.58 | v127,69.85 127,100.97 118.11,109.86 CYL2.3
  Bottom 0.508: v127,69.85 137.79,69.85 139.06,68.58 v167.64,68.58
CA_SW_4  (via drill 0.61)
  Top 0.508: E27.9 137.16,62.23 137.16,65.41 R43.2 137.16,66.67 137.16,72.39 v135.89,73.66 | v125.73,76.2 125.73,87 102.87,109.86 CYL4.3
  Bottom 0.508: v125.73,76.2 128.27,73.66 v135.89,73.66
CA_SW_8
  Top 0.508: E27.12 129.54,62.23 129.54,65.41 R42.2 129.54,66.67 130.81,67.94 130.81,76.83 128.27,79.38 128.27,121.28 97.79,121.28 87.63,111.12 CYL8.3
CA_SW_16  (via drill 0.61)
  Top 0.508: E28.9 111.76,62.23 111.76,67.94 R41.2 111.76,69.22 111.76,78.74 v90.17,100.33
  Bottom 0.508: v90.17,100.33 81.92,100.33 72.39,109.86 CYL16.3
CA_SW_32  (via drill 0.61)
  Top 0.508: E28.12 104.14,62.23 104.14,65.41 R40.2 104.14,66.67 104.14,81.28 v87.63,97.79
  Bottom 0.508: v87.63,97.79 69.22,97.79 57.15,109.86 CYL32.3
CA_SW_64  (via drill 0.61)
  Top 0.508: E29.9 63.5,44.45 63.5,50.16 R39.2 | v48.26,55.24 48.26,103.5 41.91,109.86 CYL64.3
  Bottom 0.508: v48.26,55.24 51.44,52.07 60.33,52.07 61.59,50.8 62.87,50.8 R39.2
CA_SW_128
  Top 0.508: E29.12 55.88,44.45 55.88,47.62 R38.2
  Bottom 0.508: CYL128.3 24.13,109.86 24.13,89.53 22.86,88.27 22.86,49.53 53.98,49.53 55.24,48.26 R38.2
CLOCK_H
  Top 0.508: E7.10 157.48,105.41 163.83,111.76 170.81,111.76 170.81,109.22 171.45,108.58 171.45,99.06 172.72,97.79 E8.1
  Bottom 0.508: E7.12 153.03,103.5 154.31,102.23 155.57,102.23 156.84,103.5 E7.10 | E8.1 173.35,95.89 174.62,94.61 180.97,94.61 182.25,95.89 E8.5
CONSTANT_WRITE_L  (via drill 0.61)
  Top 0.508: v204.47,96.52 201.29,99.69 v201.29,113.67
  Bottom 0.508: v204.47,96.52 234.95,96.52 240.66,90.81 261.62,90.81 261.62,92.71 260.99,93.34 254.63,93.34 252.09,95.89 E11.4 | v201.29,113.67 191.77,113.67 CONSTANT_WRITE.2
DATA_BITS
  Bottom 0.508: BIT0.3 227.33,109.86 242.57,109.86 BIT1.3 245.11,110.49 260.35,110.49 BIT2.3 | R7.1 266.06,109.22 265.43,109.86 262.89,109.86 BIT2.3 | BIT3.3 278.13,110.49 262.89,110.49 BIT2.3
DC_ERASE  (via drill 0.61)
  Top 0.508: v242.57,101.6 242.57,95.25 243.84,93.98 243.84,90.17 E9.8 | v212.09,104.14 210.82,105.41 210.82,112.39 209.55,113.67 DC_ERASE.2
  Bottom 0.508: v242.57,101.6 214.63,101.6 v212.09,104.14
FWD_L  (via drill 0.61)
  Top 0.508: R36.1 50.8,85.72 54.61,81.92 54.61,80.64 FWD/REV.3 57.15,80.64 62.23,85.72 62.23,87 v74.3,99.06 | E17.9 170.18,19.05 v170.18,20.95 165.1,26.04 165.1,39.37 160.02,44.45 160.02,80.64 148.59,92.08 148.59,98.42 v147.32,99.69
  Bottom 0.508: v170.18,20.95 192.41,20.95 194.94,18.41 E16.9 | v74.3,99.06 144.15,99.06 144.78,99.69 v147.32,99.69
GND  (via drill 0.61)
  Top 0.508: 196.85,19.05 198.12,20.32 198.12,24.77 R31.1 | 196.85,19.05 196.85,12.7 198.12,11.43 E16.7 | 232.41,10.16 231.78,10.16 C14.2 | 232.41,10.16 233.04,10.16 E14.1 | E15.10 219.07,17.14 220.34,17.14 E15.9 220.98,16.51 220.98,13.97 221.62,13.34 | 221.62,13.34 223.52,11.43 E15.7 | 221.62,13.34 219.07,10.79 E15.5 | E15.4 215.9,11.43 215.9,13.97 213.36,16.51 E15.12 212.72,17.14 211.46,17.14 E15.13 210.82,16.51 210.82,15.88 205.74,10.79 C15.2 | 232.41,10.16 232.41,29.84 230.5,31.75 SECTOR.12 | 181.61,42.55 181.61,50.8 180.34,52.07 E26.7 180.97,52.7 184.15,49.53 184.15,48.26 190.5,41.91 190.5,25.4 196.85,19.05 | 181.61,42.55 181.61,38.1 180.34,36.83 E30.4 180.34,34.29 179.07,33.02 179.07,12.06 180.34,10.79 C16.2 | 181.61,42.55 187.96,36.2 187.96,31.11 C38.2 | E24.9 208.28,59.69 210.82,57.15 210.82,54.61 E24.7 | E24.12 200.03,60.33 198.75,60.33 E24.13 198.12,59.69 198.12,59.05 194.31,55.24 | 194.31,55.24 193.04,53.98 C24.2 | 194.31,55.24 194.31,69.85 194.94,70.48 C44.- | C1.2 273.69,132.08 267.33,132.08 E2.7 266.7,130.81 266.7,122.56 262.89,118.75 BIT2.1 | C11.2 241.3,97.16 241.3,102.23 242.57,103.5 242.57,108.58 241.3,109.86 241.3,116.2 242.57,117.47 BIT1.1 242.57,118.75 242.57,129.54 241.3,130.81 E3.8 | E14.8 251.46,11.43 251.46,16.51 E14.9 251.46,19.05 251.46,27.94 254,27.94 255.27,29.21 255.27,32.38 255.91,33.02 R70.1 | E13.4 268.61,9.53 267.33,8.26 259.08,8.26 259.08,9.53 C13.2 | E12.7 294.64,11.43 292.1,13.97 292.1,16.51 E12.9 292.1,19.05 292.1,27.94 293.37,29.21 293.37,33.02 294.64,34.29 RN8.1 294.64,36.83 294,37.47 294,43.18 292.1,45.09 J2.VV
  Top 0.508: J2.B 244.47,45.72 245.75,45.72 J2.D 247.01,45.72 248.28,45.72 J2.F 249.56,45.72 250.82,45.72 J2.J 252.09,45.72 253.37,45.72 J2.L 254.63,45.72 255.91,45.72 J2.N 257.18,45.72 258.44,45.72 J2.R 259.71,45.72 260.99,45.72 J2.T 262.25,45.72 263.52,45.72 J2.V 264.8,45.72 266.06,45.72 J2.X 267.33,45.72 268.61,45.72 J2.Z 269.88,45.72 271.14,45.72 J2.BB 272.42,45.72 273.69,45.72 J2.DD 274.95,45.72 276.23,45.72 J2.FF 277.5,45.72 278.76,45.72 J2.JJ 280.04,45.72 281.31,45.72 J2.LL 282.57,45.72 283.85,45.72 J2.NN 285.12,45.72 286.38,45.72 J2.RR 287.65,45.72 288.93,45.72 J2.TT 290.19,45.72 291.46,45.72 J2.VV | C10.2 266.06,96.52 259.71,96.52 E11.7 259.08,95.25 259.08,81.92 260.35,80.64 HEAD.3 | E9.2 231.78,80.64 233.04,80.64 E9.3 | RN5.1 243.84,64.77 243.84,59.05 J1.B 243.84,57.78 243.84,56.52 J1.A 244.47,55.88 245.75,55.88 J1.C 247.01,55.88 248.28,55.88 J1.E 249.56,55.88 250.82,55.88 J1.H 252.09,55.88 253.37,55.88 J1.K 254.63,55.88 255.91,55.88 J1.M 257.18,55.88 258.44,55.88 J1.P 259.71,55.88 260.99,55.88 J1.S 262.25,55.88 263.52,55.88 J1.U 264.8,55.88 266.06,55.88 J1.W 267.33,55.88 268.61,55.88 J1.Y 269.88,55.88 271.14,55.88 J1.AA 272.42,55.88 273.69,55.88 J1.CC 274.95,55.88 276.23,55.88 J1.EE 277.5,55.88 278.76,55.88 J1.HH 280.04,55.88 281.31,55.88 J1.KK 282.57,55.88 283.85,55.88 J1.MM 285.12,55.88 286.38,55.88 J1.PP 287.65,55.88 288.93,55.88 J1.SS 290.19,55.88 291.46,55.88 J1.UU | E9.5 238.76,80.01 236.85,78.11 236.85,69.22 C52.- | C43.2 294,66.04 292.74,66.04 RN6.1 292.1,64.77 294,62.87 294,58.42 292.1,56.52 J1.UU
  Top 0.508: J2.VV 292.1,46.35 292.1,55.24 J1.UU | BIT3.1 280.67,117.47 283.21,114.94 283.21,99.06 284.48,97.79 E10.7 | C34.2 48.26,31.11 48.26,34.92 C29.2 | 36.83,33.02 36.2,32.38 36.2,28.57 C68.- 36.2,27.3 36.83,26.67 36.83,12.06 38.1,10.79 C22.2 38.1,9.53 38.1,8.26 46.35,8.26 47.62,9.53 E22.4 | 36.83,33.02 38.1,34.29 E33.4 | 36.83,45.72 29.84,45.72 27.94,43.81 C33.2 | 36.83,45.72 36.83,33.02 | C20.2 73.03,10.16 66.67,10.16 E21.4 65.41,9.53 64.14,8.26 55.88,8.26 55.88,9.53 C21.2 | E20.15 78.74,16.51 76.2,13.97 76.2,11.43 E20.1 | E19.10 119.38,16.51 119.38,12.7 118.11,11.43 118.11,8.89 118.75,8.26 121.28,8.26 121.28,9.53 E19.8 | 105.41,20.32 106.68,19.05 E19.15 | 105.41,20.32 105.41,32.38 104.14,33.66 104.14,34.92 C32.2 | 105.41,20.32 105.41,7.62 103.5,7.62 101.6,9.53 C19.2 | CONSTANT_WRITE.3 190.5,109.86 190.5,105.41 E8.9 190.5,102.87 190.5,97.79 E8.8 190.5,95.25 190.5,90.17 | 190.5,90.17 190.5,87 C45.+ | C3.2 220.98,131.44 216.53,127 R14.1 215.9,127.64 215.9,129.54 214,131.44 E4.7 213.36,130.81 213.36,94.61 211.46,92.71 POWER.1 207.01,92.71 207.01,109.86 DC_ERASE.3 | E7.7 162.56,95.25 162.56,89.53 C61.- 161.93,88.27 161.29,87.63 161.29,55.24 162.56,53.98 C26.2 | C5.2 169.54,132.08 163.19,132.08 E6.7 162.56,130.81 162.56,122.56 C60.- | CYL128.2 26.67,113.67 39.37,113.67 CYL64.2 41.91,113.67 53.34,113.67 | 53.34,113.67 54.61,113.67 CYL32.2 57.15,113.67 69.85,113.67 CYL16.2 | CYL2.2 115.57,113.67 102.87,113.67 CYL4.2 | POWER_ON.B 131.44,87 129.54,88.9 129.54,112.39 130.81,113.67 CYL1.2 133.35,114.94 134.62,116.2 | CYL8.2 85.09,113.67 80.01,108.58 80.01,67.31 76.83,64.14 C67.- 76.83,62.87 76.83,60.96 v80.01,57.78
  Top 0.508: 53.34,113.67 53.34,85.72 54.61,84.45 FWD/REV.2 | 134.62,116.2 134.62,121.28 144.78,131.44 C6.2 | 134.62,116.2 134.62,107.31 144.78,97.16 C7.2 | 190.5,90.17 170.18,90.17 170.18,95.89 C8.2 | 36.83,45.72 38.1,46.99 38.1,81.92 39.37,83.19 RTZ.2
  Bottom 0.508: E16.7 198.75,10.16 205.1,10.16 C15.2 | RN7.1 240.66,35.56 239.4,35.56 C40.2 238.12,35.56 236.85,34.29 233.68,34.29 SECTOR.11 233.04,33.66 231.78,33.66 230.5,32.38 SECTOR.12 | E15.4 216.53,9.53 217.81,9.53 E15.5 | C14.2 230.5,10.16 224.16,10.16 E15.7 | E18.7 147.96,10.16 154.31,10.16 C17.2 154.94,9.53 157.48,6.99 169.54,6.99 172.09,9.53 E17.7 173.35,10.16 179.71,10.16 C16.2 | E24.7 211.46,53.98 213.36,55.88 215.26,55.88 C36.2 | E24.12 201.29,60.33 202.56,59.05 203.84,59.05 205.1,60.33 E24.10 206.38,60.33 207.65,60.33 E24.9 208.91,61.59 210.19,62.87 226.06,62.87 227.97,60.96 R23.1 229.24,60.96 231.78,58.42 243.21,58.42 J1.B | E26.7 180.97,53.34 192.41,53.34 C24.2 | E1.7 292.1,130.81 280.04,118.75 BIT3.1 278.13,117.47 262.89,117.47 BIT2.1 260.35,117.47 245.11,117.47 BIT1.1 242.57,117.47 227.33,117.47 BIT0.1 | E3.8 241.94,132.08 248.28,132.08 C2.2 | 257.81,31.75 257.18,32.38 256.54,32.38 R70.1 | 257.81,31.75 257.81,26.04 258.44,26.04 D5.A | E13.4 269.88,10.16 276.23,10.16 C12.2 | C13.2 258.44,10.16 252.09,10.16 E14.8 | C41.2 296.55,35.56 295.27,35.56 RN8.1 294,34.92 292.74,33.66 280.67,33.66 280.04,33.02 R148.1 278.76,33.02 271.78,33.02 270.51,31.75 266.06,31.75 265.43,32.38 258.44,32.38 257.81,31.75 | C53.2 284.48,79.38 280.67,83.19 WRITE_BUTTON.2 | E10.7 284.48,95.25 284.48,84.45 280.67,84.45 WRITE_BUTTON.2 | WRITE_BUTTON.2 278.13,84.45 266.7,95.89 C10.2 | 229.24,79.38 227.33,79.38 226.06,80.64 C9.2 | 229.24,79.38 230.5,80.64 E9.2 | 229.24,79.38 236.85,79.38 238.12,80.64 E9.5 239.4,80.64 240.66,80.64 E9.6 241.94,80.64 243.21,80.64 E9.7 244.47,80.64 260.35,80.64 HEAD.3
  Bottom 0.508: RN5.1 243.21,66.04 241.94,66.04 C42.2 240.66,66.04 238.76,67.94 236.85,67.94 C52.- | RN6.1 291.46,65.41 290.19,65.41 RN6.2 289.56,67.31 288.93,67.31 287.65,68.58 C39.2 | C29.2 47.62,35.56 38.73,35.56 E33.4 | E20.1 75.56,10.16 74.3,10.16 C20.2 | E22.4 48.9,10.16 55.24,10.16 C21.2 | C22.2 37.47,10.16 31.11,10.16 E23.7 29.84,10.79 28.57,12.06 16.51,12.06 16.51,8.89 15.88,8.26 13.97,8.26 12.7,9.53 C23.2 | C30.2 169.54,35.56 154.94,35.56 153.67,36.83 FUNCTION.C1 153.03,36.83 147.96,36.83 147.32,37.47 130.18,37.47 | 130.18,37.47 131.44,36.2 E31.4 | 130.18,37.47 123.83,37.47 122.56,36.2 121.92,36.2 C31.2 121.28,35.56 114.94,35.56 E32.4 113.67,34.92 112.39,33.66 105.41,33.66 104.14,34.92 C32.2 103.5,35.56 78.74,35.56 77.47,36.83 DRIVE.C1 76.83,36.2 75.56,34.92 69.22,34.92 | C18.2 128.91,10.16 122.56,10.16 E19.8 121.28,10.79 120.02,12.06 102.87,12.06 101.6,10.79 C19.2 100.97,10.16 94.61,10.16 E20.8 | 69.22,34.92 66.67,34.92 E29.7 | 69.22,34.92 63.5,29.21 50.16,29.21 48.9,30.48 C34.2 | R15.1 215.26,111.76 214.63,111.12 209.55,111.12 DC_ERASE.3 207.01,110.49 191.77,110.49 CONSTANT_WRITE.3 | E27.7 140.34,53.98 162.56,53.98 C26.2 | C7.2 144.78,95.89 148.59,92.08 159.38,92.08 161.93,89.53 C61.- | C8.2 169.54,96.52 163.19,96.52 E7.7 | C4.2 194.94,132.08 188.59,132.08 E5.7 187.32,131.44 186.06,130.18 173.35,130.18 | C6.2 145.41,132.08 146.69,132.08 E6.1 147.96,131.44 149.22,130.18 160.66,130.18 161.93,131.44 E6.7 | E5.3 177.16,131.44 175.9,131.44 E5.2 174.62,131.44 173.35,130.18 | 173.35,130.18 171.45,130.18 170.18,131.44 C5.2 | C27.2 121.28,53.34 114.94,53.34 E28.7 113.67,52.7 109.86,48.9 83.82,48.9 83.82,52.7 84.45,53.34
  Bottom 0.508: 84.45,53.34 95.89,53.34 C28.2 | RTZ.2 41.91,83.19 54.61,83.19 FWD/REV.2 | CYL16.2 72.39,113.67 85.09,113.67 CYL8.2 87.63,113.67 100.33,113.67 CYL4.2 | CYL1.2 130.81,113.67 118.11,113.67 CYL2.2 | v80.01,57.78 84.45,53.34 | C11.2 240.66,96.52 236.22,96.52 234.95,97.79 190.5,97.79 E8.8
HEAD_SELECT_L
  Top 0.508: J1.X 266.7,59.05 266.7,64.77 RN5.10 266.7,67.31 266.7,69.85 RN1.10 266.7,72.39 266.7,79.38 262.89,83.19 HEAD.2
N$1
  Bottom 0.508: E13.1 262.25,10.79 263.52,12.06 290.19,12.06 291.46,10.79 E12.6
N$2
  Bottom 0.508: E7.6 160.66,95.89 163.19,93.34 204.47,93.34 205.1,93.98 236.22,93.98 240.66,89.53 E9.9
N$3
  Bottom 0.508: E11.13 247.01,103.5 248.28,103.5 E11.12 249.56,103.5 250.82,102.23 273.69,102.23 | 273.69,102.23 272.42,103.5 E10.13 | 273.69,102.23 282.57,102.23 283.85,103.5 E10.8
N$4
  Top 0.508: E10.11 277.5,103.5 278.76,103.5 E10.10
N$5  (via drill 0.61)
  Top 0.508: R10.1 261.62,144.15 261.62,140.97 E2.10 261.62,138.43 258.44,135.25 258.44,134.62 | v187.32,135.25 183.51,139.06 E5.10 | 258.44,134.62 259.08,133.99 259.08,133.35 E2.4 | v257.81,135.25 258.44,134.62
  Bottom 0.508: v187.32,135.25 v257.81,135.25
N$6
  Top 0.508: E7.4 154.94,97.79 154.94,102.87 E7.11
N$7
  Top 0.508: E7.5 157.48,97.79 162.56,102.87 E7.8
N$8
  Top 0.508: E11.3 249.56,95.89 250.82,94.61 255.27,94.61 255.27,101.6 256.54,102.87 E11.9
N$9  (via drill 0.61)
  Top 0.508: v202.56,104.14 204.47,106.05 204.47,120.02 212.09,127.64 212.09,137.16 213.36,138.43 E4.8
  Bottom 0.508: v202.56,104.14 193.04,104.14 191.13,106.05 161.93,106.05 160.66,104.78 E7.9
N$10  (via drill 0.61)
  Top 0.508: v262.89,13.97 266.06,10.79 E13.3 | v229.24,14.61 227.33,16.51 227.33,29.21 226.06,30.48 226.06,42.55 223.52,45.09 223.52,52.7 R20.1 223.52,53.98 223.52,55.24 C36.1
  Bottom 0.508: Q1.E 226.06,54.61 224.79,55.88 224.16,55.88 C36.1 | v262.89,13.97 262.25,14.61 v229.24,14.61
N$11  (via drill 0.61)
  Top 0.508: v177.8,116.2 177.8,105.41 E8.14
  Bottom 0.508: v177.8,116.2 174.62,119.38 173.35,119.38 C63.2
N$12
  Top 0.508: E8.6 185.42,95.25 185.42,92.08 C62.2
N$13
  Top 0.508: R9.E 165.1,120.65 167.64,118.11 R9.S 168.28,116.2 172.09,112.39 172.09,111.76 C63.1 172.72,111.12 172.72,107.95 175.26,105.41 E8.15
N$14
  Top 0.508: C62.1 193.04,92.08 195.58,94.61 195.58,95.89 R8.1
  Bottom 0.508: E8.7 188.59,95.89 189.87,94.61 193.04,94.61 194.94,96.52 R8.1
N$15  (via drill 0.61)
  Top 0.508: v231.14,102.87 231.14,91.44 233.04,89.53 E9.12 | v168.28,107.31 158.75,97.79 158.75,95.25 158.12,94.61 152.4,94.61 152.4,95.25 E7.3
  Bottom 0.508: v231.14,102.87 228.6,105.41 193.04,105.41 191.13,107.31 v168.28,107.31
N$16
  Top 0.508: R21.1 228.6,51.44 228.6,52.7 Q1.B1
N$17
  Top 0.508: Q1.B2 228.6,56.52 228.6,57.78 R22.2
N$18  (via drill 0.61)
  Top 0.508: R22.1 218.44,59.05 218.44,60.33 R23.2 | E12.13 281.94,19.05 279.4,21.59 279.4,22.23 C37.2 278.76,22.86 275.59,26.04 v275.59,40.01 | v236.85,57.15 237.49,56.52 v237.49,40.01
  Bottom 0.508: v236.85,57.15 220.34,57.15 219.07,58.42 R22.1 | v237.49,40.01 v275.59,40.01
N$19  (via drill 0.61)
  Top 0.508: E12.12 284.48,19.05 287.02,21.59 287.02,22.23 C37.1 | v44.45,53.34 44.45,15.24 40.64,11.43 E22.1 | v162.56,63.5 165.1,66.04 v165.1,73.03 | v234.31,73.03 234.31,45.09 236.22,43.18 236.22,31.11 234.95,29.84 234.95,12.7 235.59,12.06 | 235.59,12.06 236.22,11.43 E14.2 | v247.65,12.7 247.65,15.24 248.92,16.51 E14.10 | v240.03,12.06 235.59,12.06
  Bottom 0.508: v44.45,53.34 51.44,60.33 93.98,60.33 97.16,63.5 v162.56,63.5 | v165.1,73.03 v234.31,73.03 245.11,73.03 245.11,64.77 249.56,60.33 302.26,60.33 302.26,29.84 297.81,25.4 290.19,25.4 287.65,22.86 C37.1 | v247.65,12.7 247.01,12.06 v240.03,12.06
N$20
  Bottom 0.508: E17.1 158.12,9.53 159.38,8.26 168.28,8.26 169.54,9.53 E17.6
N$21  (via drill 0.61)
  Top 0.508: v62.23,19.68 62.23,15.24 58.42,11.43 E21.1 | v130.81,20.32 135.89,25.4 v135.89,31.75 | v154.94,33.66 157.48,31.11 157.48,20.32 158.75,19.05 158.75,15.88 162.56,12.06 162.56,11.43 E17.3
  Bottom 0.508: v62.23,19.68 62.87,20.32 76.2,20.32 80.01,24.13 111.12,24.13 114.94,20.32 v130.81,20.32 | v135.89,31.75 148.59,31.75 150.5,33.66 v154.94,33.66 | E17.4 164.47,9.53 163.19,9.53 E17.3
N$22
  Top 0.508: E14.15 236.22,19.05 236.22,22.23 C35.1 236.22,23.5 236.22,24.77 R25.1
N$23
  Top 0.508: E14.14 239.4,18.41 243.21,22.23 243.21,22.86 C35.2
N$24
  Top 0.508: E14.7 248.92,8.89 248.92,5.71 R28.1 249.56,5.08 254,9.53 254,22.23 C25.1
N$25
  Top 0.508: E14.6 246.38,11.43 245.11,12.7 245.11,20.95 246.38,22.23 C25.2
N$26  (via drill 0.61)
  Top 0.508: v83.82,14.61 83.82,11.43 E20.4
  Bottom 0.508: v83.82,14.61 82.55,15.88 80.64,15.88 80.01,16.51 80.01,20.95 108.58,20.95 111.12,18.41 E19.13
N$27  (via drill 0.61)
  Top 0.508: v86.36,14.61 86.36,11.43 E20.5 | v112.39,14.61 114.3,16.51 E19.12
  Bottom 0.508: v86.36,14.61 v112.39,14.61
N$28  (via drill 0.61)
  Top 0.508: v117.47,6.99 114.94,9.53 E19.5 | v147.32,6.99 152.4,12.06 158.75,12.06 158.75,8.26 v163.19,3.81 | v190.5,3.81 195.58,8.89 E16.6
  Bottom 0.508: v117.47,6.99 v147.32,6.99 | v163.19,3.81 v190.5,3.81
N$29  (via drill 0.61)
  Top 0.508: v207.01,145.41 207.01,149.86 160.66,149.86 158.75,147.96 158.75,134.62 160.02,133.35 E6.6 | v220.34,145.41 225.43,140.34 E3.15
  Bottom 0.508: v207.01,145.41 v220.34,145.41
N$30
  Bottom 0.508: RUN.2 26.67,84.45 27.3,85.09 37.47,85.09 39.37,87 RTZ.1
N$31
  Bottom 0.508: E6.12 153.03,139.06 154.31,137.79 226.69,137.79 227.97,139.06 E3.14
N$32  (via drill 0.61)
  Top 0.508: v223.52,149.22 231.14,141.6 231.14,140.97 E3.13
  Bottom 0.508: v223.52,149.22 210.82,149.22 210.19,148.59 166.37,148.59 158.12,140.34 E6.10
N$33  (via drill 0.61)
  Top 0.508: v230.5,144.15 233.68,140.97 E3.12
  Bottom 0.508: v230.5,144.15 191.13,144.15 190.5,143.51 166.37,143.51 163.19,140.34 E6.8
N$34
  Top 0.508: E6.2 150.5,131.44 151.76,131.44 E6.3
N$35  (via drill 0.61)
  Top 0.508: v119.38,29.21 119.38,25.4 115.57,21.59 115.57,15.24 111.76,11.43 E19.4 | v130.18,29.21 130.81,29.84 v130.81,46.35 | v187.96,46.35 199.39,34.92 199.39,20.32 198.12,19.05 E16.8
  Bottom 0.508: v119.38,29.21 v130.18,29.21 | v130.81,46.35 v187.96,46.35
N$36  (via drill 0.61)
  Top 0.508: E10.4 277.5,95.89 278.76,95.89 E10.5 | v267.97,122.56 270.51,120.02 270.51,99.06 271.78,97.79 E10.2
  Bottom 0.508: E10.1 269.88,95.89 271.14,95.89 E10.2 272.42,95.89 273.69,94.61 274.95,94.61 276.23,95.89 E10.4 | v267.97,122.56 229.87,122.56 229.24,123.19 214,123.19 212.72,124.46 143.51,124.46 143.51,132.72 144.78,133.99 153.03,133.99 154.31,132.72 E6.4
N$37
  Top 0.508: R1.1 71.12,79.38 71.12,83.19 ADDR_INV.A
N$38
  Top 0.508: R2.1 86.36,79.38 86.36,83.19 SEEK_INC.A
N$39
  Top 0.508: R3.1 132.08,79.38 132.08,83.19 POWER_ON.A
N$40  (via drill 0.61)
  Top 0.508: v171.45,23.5 171.45,20.32 172.72,19.05 E17.8
  Bottom 0.508: 114.94,15.88 90.81,15.88 89.53,17.14 E20.11 | 114.94,15.88 116.2,17.14 E19.11 | v171.45,23.5 154.31,23.5 152.4,21.59 135.89,21.59 133.35,19.05 133.35,15.88 114.94,15.88
N$41  (via drill 0.61)
  Top 0.508: v182.88,48.9 182.88,48.26 189.23,41.91 189.23,20.32 187.96,19.05 E16.12 | v140.34,48.9 137.16,45.72 v137.16,40.01 | v113.67,40.01 110.49,36.83 110.49,22.86 109.22,21.59 109.22,19.05 E19.14
  Bottom 0.508: E20.14 81.92,18.41 83.19,19.68 107.31,19.68 108.58,18.41 E19.14 | v140.34,48.9 v182.88,48.9 | v113.67,40.01 v137.16,40.01
N$42  (via drill 0.61)
  Top 0.508: v205.74,30.48 205.74,34.29 E25.2
  Bottom 0.508: C38.1 196.22,30.48 197.49,30.48 R29.1 198.75,30.48 v205.74,30.48
N$43  (via drill 0.61)
  Top 0.508: E25.6 208.28,41.91 207.01,40.64 207.01,32.38 208.28,31.11 R29.2 | v236.22,29.21 v240.03,25.4
  Bottom 0.508: 206.38,29.21 207.65,30.48 R29.2 | 206.38,29.21 205.1,27.94 198.75,27.94 R30.2 | v240.03,25.4 253.37,25.4 255.91,22.86 258.44,22.86 R32.1 | v236.22,29.21 206.38,29.21
N$44
  Top 0.508: R31.2 208.28,26.04 208.28,27.3 R30.1 208.28,28.57 209.55,29.84 209.55,33.02 208.28,34.29 E25.3
N$46  (via drill 0.61)
  Top 0.508: v83.19,6.99 85.09,8.89 85.09,24.77 86.36,26.04 v86.36,36.83 | v182.88,39.37 186.69,35.56 186.69,5.71 189.87,2.54 210.19,2.54 | 210.19,2.54 210.19,9.53 E15.2 | v274.32,1.27 281.94,8.89 E12.2 | v211.46,1.27 210.19,2.54
  Bottom 0.508: v83.19,6.99 20.95,6.99 18.41,9.53 E23.2 | v86.36,36.83 87.63,38.1 123.19,38.1 123.83,38.73 142.88,38.73 144.78,40.64 152.4,40.64 153.03,41.27 180.97,41.27 v182.88,39.37 | v274.32,1.27 v211.46,1.27
N$47  (via drill 0.61)
  Top 0.508: v208.91,3.81 208.91,8.26 208.28,8.89 E15.1 | v240.03,3.81 241.3,5.08 241.3,8.89 E14.4
  Bottom 0.508: v208.91,3.81 v240.03,3.81
N$48
  Bottom 0.508: D3.A 54.61,25.4 55.88,26.67 60.96,26.67 62.23,27.94 D2.C
N$53
  Bottom 0.508: D4.A 54.61,22.86 57.15,25.4 62.23,25.4 D3.C
N$55  (via drill 0.61)
  Top 0.508: v269.88,14.61 267.33,17.14 E13.6 | v285.75,14.61 287.02,13.34 287.02,11.43 E12.4
  Bottom 0.508: v269.88,14.61 v285.75,14.61
N$57  (via drill 0.61)